# Altium schematic sheet Communication Connectors.SchDoc
size A; SheetNumber: 7; SheetTotal: 7
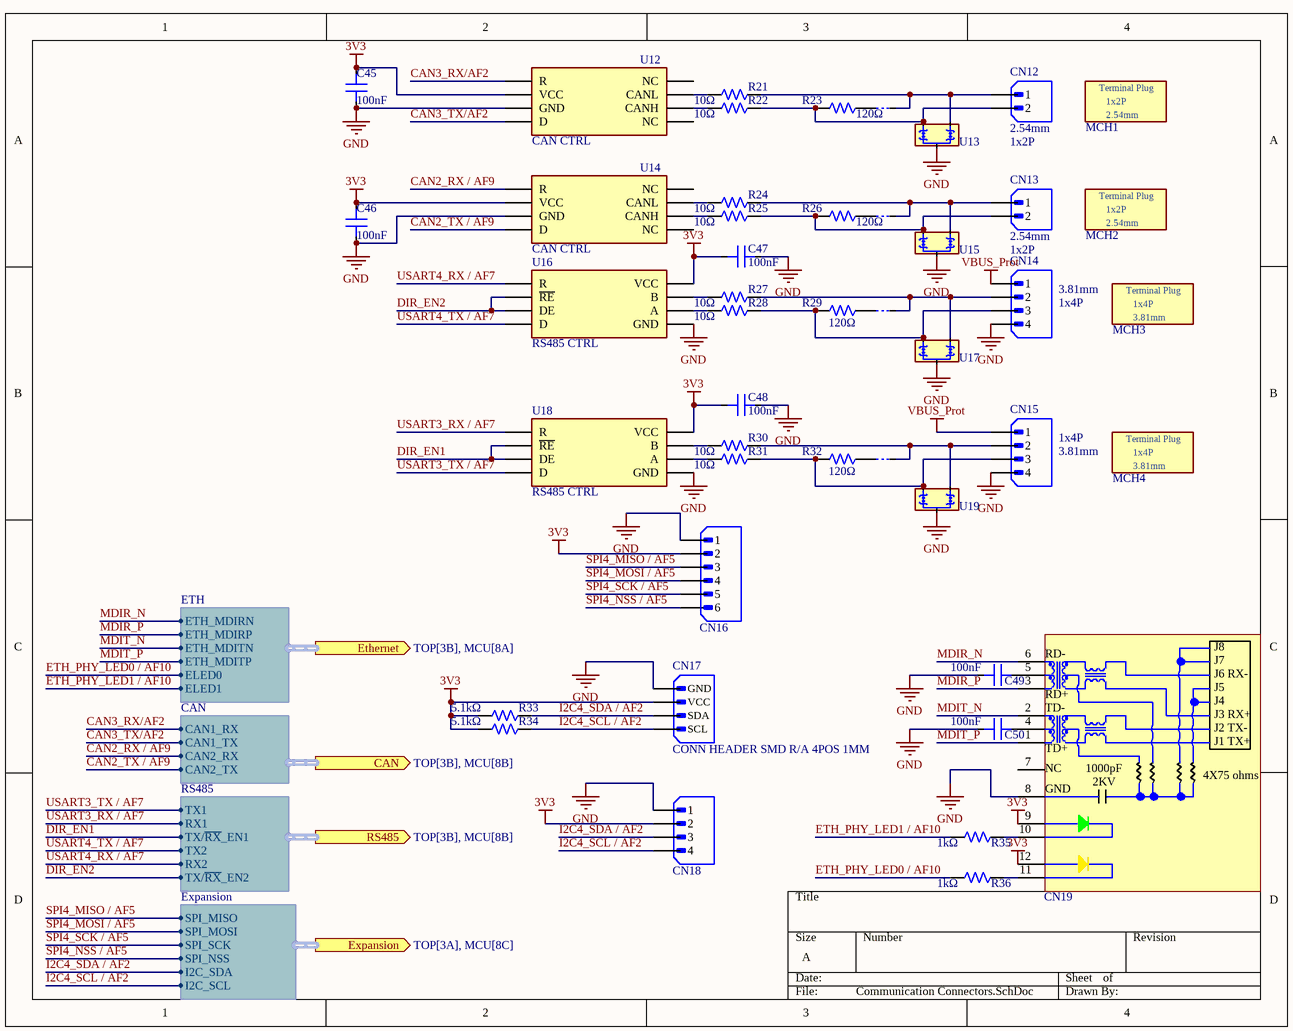
[diagram p0: Communication Connectors.SchDoc]

## Parts
C45  Capacitance: 100nF  [C_0603]  (hidden comment: CAP CER 100nF 50V X7R 0603)
C46  Capacitance: 100nF  [C_0603]  (hidden comment: CAP CER 100nF 50V X7R 0603)
C47  Capacitance: 100nF  [C_0603]  (hidden comment: CAP CER 100nF 50V X7R 0603)
C48  Capacitance: 100nF  [C_0603]  (hidden comment: CAP CER 100nF 50V X7R 0603)
C49  Capacitance: 100nF  [C_0603]  (hidden comment: CAP CER 100nF 50V X7R 0603)
C50  Capacitance: 100nF  [C_0603]  (hidden comment: CAP CER 100nF 50V X7R 0603)
CN12  Pitch: 2.54mm  Positions: 1x2P  [TB_2P_2.54MM_PLUGGABLE_RA]  (hidden comment: TERM BLOCK HDR 2POS 2.54mm)
CN13  Pitch: 2.54mm  Positions: 1x2P  [TB_2P_2.54MM_PLUGGABLE_RA]  (hidden comment: TERM BLOCK HDR 2POS 2.54mm)
CN14  Positions: 1x4P  Pitch: 3.81mm  [TB_4P_3.81MM_PLUGGABLE_RA]  (hidden comment: TERM BLOCK HDR 4POS 3.81mm)
CN15  Positions: 1x4P  Pitch: 3.81mm  [TB_4P_3.81MM_PLUGGABLE_RA]  (hidden comment: TERM BLOCK HDR 4POS 3.81mm)
CN16  CONN HEADER TH 6POS 2.5mm  [JST_XH_6P_2.5MM_TH]  (value not drawn)
CN17  CONN HEADER SMD R/A 4POS 1MM  [JST_SH_4P_1MM_SMD_RA]
CN18  CONN HEADER TH 4POS 2.5mm  [JST_XH_4P_2.5MM_TH]  (value not drawn)
CN19  CONN MOD JACK RJ45 TH  [HR911105A]  (value not drawn)
J2  JUMPER SMD  [JUMPER SMD 3X1.5 mm]  (value not drawn)  (no BOM)
J3  JUMPER SMD  [JUMPER SMD 3X1.5 mm]  (value not drawn)  (no BOM)
J4  JUMPER SMD  [JUMPER SMD 3X1.5 mm]  (value not drawn)  (no BOM)
J5  JUMPER SMD  [JUMPER SMD 3X1.5 mm]  (value not drawn)  (no BOM)
MCH1  TERM BLOCK PLUG 2POS 2.54mm  (value not drawn)  (mechanical)
MCH2  TERM BLOCK PLUG 2POS 2.54mm  (value not drawn)  (mechanical)
MCH3  TERM BLOCK PLUG 4POS 3.81mm  (value not drawn)  (mechanical)
MCH4  TERM BLOCK PLUG 4POS 3.81mm  (value not drawn)  (mechanical)
R21  Resistance: 10Ω  [R_0603]  (hidden comment: RES 10Ω ±5% 330mW PULSE RESIST 0603)
R22  Resistance: 10Ω  [R_0603]  (hidden comment: RES 10Ω ±5% 330mW PULSE RESIST 0603)
R23  Resistance: 120Ω  [R_1210]  (hidden comment: RES 120Ω ±1% 500mW 1210)
R24  Resistance: 10Ω  [R_0603]  (hidden comment: RES 10Ω ±5% 330mW PULSE RESIST 0603)
R25  Resistance: 10Ω  [R_0603]  (hidden comment: RES 10Ω ±5% 330mW PULSE RESIST 0603)
R26  Resistance: 120Ω  [R_1210]  (hidden comment: RES 120Ω ±1% 500mW 1210)
R27  Resistance: 10Ω  [R_0603]  (hidden comment: RES 10Ω ±5% 330mW PULSE RESIST 0603)
R28  Resistance: 10Ω  [R_0603]  (hidden comment: RES 10Ω ±5% 330mW PULSE RESIST 0603)
R29  Resistance: 120Ω  [R_1210]  (hidden comment: RES 120Ω ±1% 500mW 1210)
R30  Resistance: 10Ω  [R_0603]  (hidden comment: RES 10Ω ±5% 330mW PULSE RESIST 0603)
R31  Resistance: 10Ω  [R_0603]  (hidden comment: RES 10Ω ±5% 330mW PULSE RESIST 0603)
R32  Resistance: 120Ω  [R_1210]  (hidden comment: RES 120Ω ±1% 500mW 1210)
R33  Resistance: 5.1kΩ  [R_0603]  (hidden comment: RES 5.1kΩ ±1% 100mW 0603)
R34  Resistance: 5.1kΩ  [R_0603]  (hidden comment: RES 5.1kΩ ±1% 100mW 0603)
R35  Resistance: 1kΩ  [R_0603]  (hidden comment: RES 1kΩ ±1% 100mW 0603)
R36  Resistance: 1kΩ  [R_0603]  (hidden comment: RES 1kΩ ±1% 100mW 0603)
U12  CAN CTRL  [SOIC-8]
U13  ESD DIODE 24VWM 70VC SOT-23  [SOT-23]  (value not drawn)
U14  CAN CTRL  [SOIC-8]
U15  ESD DIODE 24VWM 70VC SOT-23  [SOT-23]  (value not drawn)
U16  RS485 CTRL  [SOIC-8]
U17  ESD DIODE 12VWM 7VWM 26VC 14VC SOT-23  [SOT-23]  (value not drawn)
U18  RS485 CTRL  [SOIC-8]
U19  ESD DIODE 12VWM 7VWM 26VC 14VC SOT-23  [SOT-23]  (value not drawn)

## Ports
CAN (out, harness CAN, see TOP[3B], MCU[8B]), Ethernet (out, harness ETH, see TOP[3B], MCU[8A]), Expansion (out, harness Expansion, see TOP[3A], MCU[8C]), RS485 (out, harness RS485, see TOP[3B], MCU[8B])

## Harnesses
Expansion: SPI_MISO, SPI_MOSI, SPI_SCK, SPI_NSS, I2C_SDA, I2C_SCL
RS485: TX1, RX1, TX/~{R}~{X}_EN1, TX2, RX2, TX/~{R}~{X}_EN2
CAN: CAN1_RX, CAN1_TX, CAN2_TX, CAN2_RX
ETH: ETH_MDIRN, ETH_MDIRP, ETH_MDITN, ETH_MDITP, ELED0, ELED1

## Nets
3V3: C45.2 C46.2 C47.1 C48.1 CN16.2 CN17.2(VCC) CN18.2 CN19.9 CN19.12 R33.1 R34.1 U12.3(VCC) U14.3(VCC) U16.8(VCC) U18.8(VCC)
GND: C45.1 C46.1 C47.2 C48.2 C49.2 C50.2 CN14.4 CN15.4 CN16.1 CN17.1(GND) CN18.1 CN19.8 U12.2(GND) U13.3 U14.2(GND) U15.3 U16.5(GND) U17.3 U18.5(GND) U19.3
VBUS_Prot: CN14.1 CN15.1
CAN2_RX / AF9: U14.4(R) ; port CAN.CAN2_RX
CAN2_TX / AF9: U14.1(D) ; port CAN.CAN2_TX
CAN3_RX/AF2: U12.4(R) ; port CAN.CAN1_RX
CAN3_TX/AF2: U12.1(D) ; port CAN.CAN1_TX
DIR_EN1: U18.2(~{R}~{E}) U18.3(DE) ; port RS485.TX/~{R}~{X}_EN1
DIR_EN2: U16.2(~{R}~{E}) U16.3(DE) ; port RS485.TX/~{R}~{X}_EN2
ETH_PHY_LED0 / AF10: R36.1 ; port Ethernet.ELED0
ETH_PHY_LED1 / AF10: R35.1 ; port Ethernet.ELED1
I2C4_SCL / AF2: CN17.4(SCL) CN18.4 R34.2 ; port Expansion.I2C_SCL
I2C4_SDA / AF2: CN17.3(SDA) CN18.3 R33.2 ; port Expansion.I2C_SDA
MDIR_N: CN19.6 ; port Ethernet.ETH_MDIRN
MDIR_P: CN19.3 ; port Ethernet.ETH_MDIRP
MDIT_N: CN19.2 ; port Ethernet.ETH_MDITN
MDIT_P: CN19.1 ; port Ethernet.ETH_MDITP
SPI4_MISO / AF5: CN16.3 ; port Expansion.SPI_MISO
SPI4_MOSI / AF5: CN16.4 ; port Expansion.SPI_MOSI
SPI4_NSS / AF5: CN16.6 ; port Expansion.SPI_NSS
SPI4_SCK / AF5: CN16.5 ; port Expansion.SPI_SCK
USART3_RX / AF7: U18.1(R) ; port RS485.RX1
USART3_TX / AF7: U18.4(D) ; port RS485.TX1
USART4_RX / AF7: U16.1(R) ; port RS485.RX2
USART4_TX / AF7: U16.4(D) ; port RS485.TX2
NetC49_1: C49.1 CN19.5
NetC50_1: C50.1 CN19.4
NetCN12_1: CN12.1 J2.1 R21.2 U13.1
NetCN12_2: CN12.2 R22.2 R23.1 U13.2
NetCN13_1: CN13.1 J3.1 R24.2 U15.1
NetCN13_2: CN13.2 R25.2 R26.1 U15.2
NetCN14_2: CN14.2 J4.1 R27.2 U17.1
NetCN14_3: CN14.3 R28.2 R29.1 U17.2
NetCN15_2: CN15.2 J5.1 R30.2 U19.1
NetCN15_3: CN15.3 R31.2 R32.1 U19.2
NetCN19_10: CN19.10 R35.2
NetCN19_11: CN19.11 R36.2
NetJ2_2: J2.2(G) R23.2
NetJ3_2: J3.2(G) R26.2
NetJ4_2: J4.2(G) R29.2
NetJ5_2: J5.2(G) R32.2
NetR21_1: R21.1 U12.6(CANL)
NetR22_1: R22.1 U12.7(CANH)
NetR24_1: R24.1 U14.6(CANL)
NetR25_1: R25.1 U14.7(CANH)
NetR27_1: R27.1 U16.7(B)
NetR28_1: R28.1 U16.6(A)
NetR30_1: R30.1 U18.7(B)
NetR31_1: R31.1 U18.6(A)

Not connected (* = marked no-connect by the designer): CN19 7; U12 5(NC) 8(NC); U14 5(NC) 8(NC)

## Notes on the sheet
- (in symbol DB2EK-2.54-2P-GN-S) Terminal Plug
- (in symbol HR911105A) J8; RD-; J7; J6; RX-; J5; RD+; J4; TD-; J3; RX+; J2; TX-; J1; TX+; TD+; NC; 1000pF; 4X75 ohms; 2KV; GND
- (in symbol WJ15EDGK-3.81-04P-14-00A) Terminal Plug

## Library data of the parts
C45-C50 = CC0603KRX7R9BB104: 100nF ±10% 50V Ceramic Capacitor X7R 0603; Manufacturer: YAGEO; Symbol Path 1: Symbols\Standard.SchLib; Unit Price (USD): 0.0175; Voltage Rating: 50V; MPN: CC0603KRX7R9BB104; LCSC Part #: C14663; Package: 0603; JLC Part Type: Basic; LCSC Stock: 10701000; JLC Stock: 72739428; MOQ: 50; Datasheet: https://datasheet.lcsc.com/datasheet/pdf/23ccee80ee542e7cf156a772bb589942.pdf?productCode=C14663; URL: https://www.lcsc.com/product-detail/C14663.html; Status: ok; Tolerance: ±10%; TempCo: X7R
CN12 CN13 = DB2ERC-2.54-2P-GN: 2 Position Board Side/Socket - Closed 2.54mm Pitch Right-Angle Pin; Manufacturer: DORABO; Symbol Path 1: Symbols\Standard_CONN.SchLib; Unit Price (USD): 0.1062; Current Rating: 5A; Voltage Rating: 320V; MPN: DB2ERC-2.54-2P-GN; LCSC Part #: C2927503; Package: THROUGH HOLE,RIGHT ANGLE,P=2.54MM; JLC Part Type: Extended; LCSC Stock: 8310; JLC Stock: 8314; MOQ: 5; Datasheet: https://datasheet.lcsc.com/datasheet/pdf/f651898e52c2c09340dc9afdd199f904.pdf?productCode=C2927503; URL: https://www.lcsc.com/product-detail/C2927503.html; Status: ok; Type: Board Side/Socket - Closed
CN14 CN15 = WJ15EDGRC-3.81-04P-14-00A: 4 Position Board Side/Socket - Closed 3.81mm Pitch Right-Angle Pin; Manufacturer: KANGNEX; Symbol Path 1: Symbols\Standard_CONN.SchLib; Unit Price (USD): 0.0715; Current Rating: 8A; Voltage Rating: 300V; MPN: WJ15EDGRC-3.81-04P-14-00A; LCSC Part #: C7245; Package: THROUGH HOLE,RIGHT ANGLE,P=3.81MM; JLC Part Type: Extended; LCSC Stock: 85450; JLC Stock: 96550; MOQ: 10; Datasheet: https://datasheet.lcsc.com/datasheet/pdf/e76c1f40005fdcfb29a7fd927a19562f.pdf?productCode=C7245; URL: https://www.lcsc.com/product-detail/C7245.html; Status: ok; Type: Board Side/Socket - Closed
CN16 = B6B-XH-A(LF)(SN): Connector Header 6 position 2.5mm Pitch 3A Through Hole -25℃~+85℃; Manufacturer: JST; Symbol Path 1: Symbols\Standard_CONN.SchLib; Unit Price (USD): 0.092; Positions: 6P; Rows: 1; MPN: B6B-XH-A(LF)(SN); LCSC Part #: C144397; Package: Through Hole,P=2.5mm; JLC Part Type: Extended; LCSC Stock: 41250; JLC Stock: 41255; MOQ: 5; Datasheet: https://datasheet.lcsc.com/datasheet/pdf/51bbcb0476af7caf7f697437212da775.pdf?productCode=C144397; URL: https://www.lcsc.com/product-detail/C144397.html; Status: ok; Pitch: 2.5mm
CN17 = STEMMA QT CONNECTOR: Supplier 1: LCSC; Supplier Part Number 1: C51940130
CN18 = B4B-XH-A(LF)(SN): Connector Header 4 position 2.5mm Pitch 3A Through Hole -25℃~+85℃; Manufacturer: JST; Symbol Path 1: Symbols\Standard_CONN.SchLib; Unit Price (USD): 0.0602; Positions: 4P; Rows: 1; MPN: B4B-XH-A(LF)(SN); LCSC Part #: C144395; Package: Through Hole,P=2.5mm; JLC Part Type: Extended; LCSC Stock: 41250; JLC Stock: 41232; MOQ: 10; Datasheet: https://datasheet.lcsc.com/datasheet/pdf/51bbcb0476af7caf7f697437212da775.pdf?productCode=C144395; URL: https://www.lcsc.com/product-detail/C144395.html; Status: ok; Pitch: 2.5mm
CN19 = HR911105A: Jack Modular Connector RJ45 Through Hole; Manufacturer: HANRUN(Zhongshan HanRun Elec); Symbol Path 1: Symbols\Standard_CONN.SchLib; Unit Price (USD): 1.7285; MPN: HR911105A; LCSC Part #: C12074; Package: THROUGH HOLE; JLC Part Type: Extended; LCSC Stock: 28088; JLC Stock: 58777; MOQ: 1; Datasheet: https://datasheet.lcsc.com/datasheet/pdf/0ad5e0c00dfc47fb8e582f15f877f290.pdf?productCode=C12074; URL: https://www.lcsc.com/product-detail/C12074.html; Status: ok; Mounting Type: Right Angle; Type: RJ45 Jack
MCH1 MCH2 = DB2EK-2.54-2P-GN-S: 2 Position Plug 2.54mm Pitch; Manufacturer: DORABO; Symbol Path 1: Symbols\Standard_CONN.SchLib; Unit Price (USD): 0.3949; Positions: 1x2P; Current Rating: 5A; Voltage Rating: 320V; MPN: DB2EK-2.54-2P-GN-S; LCSC Part #: C2927483; Package: P=2.54mm; JLC Part Type: Extended; LCSC Stock: 10165; JLC Stock: 10169; MOQ: 5; Datasheet: https://datasheet.lcsc.com/datasheet/pdf/0e7e44909273aadd3468b6b2aa7bfd44.pdf?productCode=C2927483; URL: https://www.lcsc.com/product-detail/C2927483.html; Status: ok; Pitch: 2.54mm; Type: Male Plug
MCH3 MCH4 = WJ15EDGK-3.81-04P-14-00A: 4 Position Male Plug 3.81mm Pitch; Manufacturer: KANGNEX; Symbol Path 1: Symbols\Standard_CONN.SchLib; Unit Price (USD): 0.3321; Positions: 1x4P; Current Rating: 8A; Voltage Rating: 300V; MPN: WJ15EDGK-3.81-04P-14-00A; LCSC Part #: C7244; Package: P=3.81MM; JLC Part Type: Extended; LCSC Stock: 73825; JLC Stock: 73825; MOQ: 5; Datasheet: https://datasheet.lcsc.com/datasheet/pdf/b8435c9e735f1983017bbee241b51965.pdf?productCode=C7244; URL: https://www.lcsc.com/product-detail/C7244.html; Status: ok; Pitch: 3.81mm; Type: Male Plug
R21 R22 R24 R25 R27 R28 R30 R31 = CRCW060310R0JNEAHP: RES 10Ω ±5% 330mW 0603; Manufacturer: VISHAY; Symbol Path 1: Symbols\Standard.SchLib; Unit Price (USD): 0.0466; Voltage Rating: 75V; TempCo: ±200ppm/℃; MPN: CRCW060310R0JNEAHP; Package: 0603; Datasheet: https://datasheet.lcsc.com/datasheet/pdf/26cdfc55b8426b7658fe52a27bb4d16c.pdf?productCode=C844519; Power: 330mW; LCSC Part #: C844519; JLC Part Type: Extended; LCSC Stock: 5210; JLC Stock: 17062; MOQ: 10; URL: https://www.lcsc.com/product-detail/C844519.html; Status: ok; Tolerance: ±5%; Composition: Thick Film Resistor
R23 R26 R29 R32 = FRC1210F1200TS: 120Ω ±1% 500mW 1210 Thick Film Resistor; Manufacturer: FOJAN; Symbol Path 1: Symbols\Standard.SchLib; Unit Price (USD): 0.0133; Voltage Rating: 200V; TempCo: ±100ppm/℃; MPN: FRC1210F1200TS; Package: 1210; Datasheet: https://datasheet.lcsc.com/datasheet/pdf/325b65d8147ef4022498521ae6851a85.pdf?productCode=C2974062; Power: 500mW; LCSC Part #: C2974062; JLC Part Type: Extended; LCSC Stock: 141650; JLC Stock: 142815; MOQ: 50; URL: https://www.lcsc.com/product-detail/C2974062.html; Status: ok; Tolerance: ±1%; Composition: Thick Film Resistor
R33 R34 = 0603WAF5101T5E: 5.1kΩ ±1% 100mW 0603 Thick Film Resistor; Manufacturer: UNI-ROYAL; Symbol Path 1: Symbols\Standard.SchLib; Unit Price (USD): 0.0026; Voltage Rating: 75V; TempCo: ±100ppm/℃; MPN: 0603WAF5101T5E; Package: 0603; Datasheet: https://datasheet.lcsc.com/datasheet/pdf/0a975aaa49b7c97f38a963127be4a823.pdf?productCode=C23186; Power: 100mW; LCSC Part #: C23186; JLC Part Type: Basic; LCSC Stock: 11090800; JLC Stock: 15519253; MOQ: 100; URL: https://www.lcsc.com/product-detail/C23186.html; Status: ok; Tolerance: ±1%; Composition: Thick Film Resistor
R35 R36 = 0603WAF1001T5E: 1kΩ ±1% 100mW 0603 Thick Film Resistor; Manufacturer: UNI-ROYAL; Symbol Path 1: Symbols\Standard.SchLib; Unit Price (USD): 0.0058; Voltage Rating: 75V; TempCo: ±100ppm/℃; MPN: 0603WAF1001T5E; Package: 0603; Datasheet: https://datasheet.lcsc.com/datasheet/pdf/0a975aaa49b7c97f38a963127be4a823.pdf?productCode=C21190; Power: 100mW; LCSC Part #: C21190; JLC Part Type: Basic; LCSC Stock: 7626000; JLC Stock: 31254885; MOQ: 100; URL: https://www.lcsc.com/product-detail/C21190.html; Status: ok; Tolerance: ±1%; Composition: Thick Film Resistor
U12 U14 = SN65HVD230DR: 3.3-V CAN TRANSCEIVERS; Manufacturer: TI; Symbol Path 1: Symbols\Standard_ICs.SchLib; Unit Price (USD): 0.769; LCSC Part #: C12084; MPN: SN65HVD230DR; Package: SOIC-8; JLC Part Type: Extended; LCSC Stock: 59079; JLC Stock: 99088; MOQ: 1; Datasheet: https://datasheet.lcsc.com/datasheet/pdf/5f0a15e636e3498a8a69f46b0b740274.pdf?productCode=C12084; URL: https://www.lcsc.com/product-detail/C12084.html; Status: ok; Category: Interface; Subcategory: Drivers, Receivers, Transceivers
  U14: Supplier 1: DigiKey; Supplier Part Number 1: 296-11654-6-ND; Supplier 2: LCSC; Supplier Part Number 2: C12084
U13 U15 = PESD1CAN,215: 70VC Clamp 3A@8/20us Ipp ESD DIODE SOT-23; Manufacturer: Nexperia; Symbol Path 1: Symbols\Standard.SchLib; Unit Price (USD): 0.069; Reverse Standoff: 24V; Breakdown: 27.8V; Clamping: 70V; Channels: 2; Polarity: Bidirectional; Power: 200W@8/20us; MPN: PESD1CAN,215; LCSC Part #: C15771; Package: SOT-23; JLC Part Type: Extended; LCSC Stock: 308860; JLC Stock: 310541; MOQ: 10; Datasheet: https://datasheet.lcsc.com/datasheet/pdf/f7e17f2784b44a479860aa1ec967b207.pdf?productCode=C15771; URL: https://www.lcsc.com/product-detail/C15771.html; Status: ok
U16 U18 = SN65HVD75DR: SN65HVD72, SN65HVD75, SN65HVD78 3.3V Power Supply RS-485 with IEC ESD Protection; Manufacturer: TI; Symbol Path 1: Symbols\Standard_ICs.SchLib; Unit Price (USD): 0.495; Supplier 1: DigiKey; Supplier Part Number 1: 296-38570-1-ND; Supplier 2: LCSC; Supplier Part Number 2: C57928; MPN: SN65HVD75DR; LCSC Part #: C57928; Package: SOIC-8; JLC Part Type: Extended; LCSC Stock: 29102; JLC Stock: 30725; MOQ: 1; Datasheet: https://datasheet.lcsc.com/datasheet/pdf/819838ee06654d4b8c9e76b0a4745f2b.pdf?productCode=C57928; URL: https://www.lcsc.com/product-detail/C57928.html; Status: ok; Category: Interface; Subcategory: Drivers, Receivers, Transceivers
U17 U19 = CDSOT23-SM712: 26VC 14VC Clamp ESD DIODE SOT-23; Manufacturer: BOURNS; Symbol Path 1: Symbols\Standard.SchLib; Unit Price (USD): 0.4607; Reverse Standoff: 12V;7V; Breakdown: 13.3V;7.5V; Clamping: 26V;14V; Channels: 2; Power: 400W; MPN: CDSOT23-SM712; LCSC Part #: C404012; Package: SOT-23; JLC Part Type: Extended; LCSC Stock: 561; JLC Stock: 2781; MOQ: 1; Datasheet: https://datasheet.lcsc.com/datasheet/pdf/2865bdba48a423ee98c5cbe65f2ff7c7.pdf?productCode=C404012; URL: https://www.lcsc.com/product-detail/C404012.html; Status: ok